# Altium project PROC154E3_SCH.PrjPcb (part 24 of 60)

## Sheet 25. SOC GND & KELVIN SENSING.SchDoc: SOC - GROUND & KELVIN SENSING
size 513 x 386 mm; Project: PROC154E2(001)_SK_AM69; Issue: 1.0; RevCode: E3; Page Create Date: March  8, 1995; Variant Name: Core Design; Schematic Page Number: 25; Page Number: 25; Page Size: C; Comment: MISTRAL_TITLEBLK_CSIZE_1; Page Count: 62; Schematic Page Count: 62; Name: PROC154E2 001 SK AM69; DsnPath: C:\Users\danie\Downloads\sprr466c\PROC154E3_RP\PROC154E3_SCH.DSN; SchematicName: SCHEMATIC1; PageName: 25. SOC GND & KELVIN SENSING; PageSize: C; TopSchematic: True
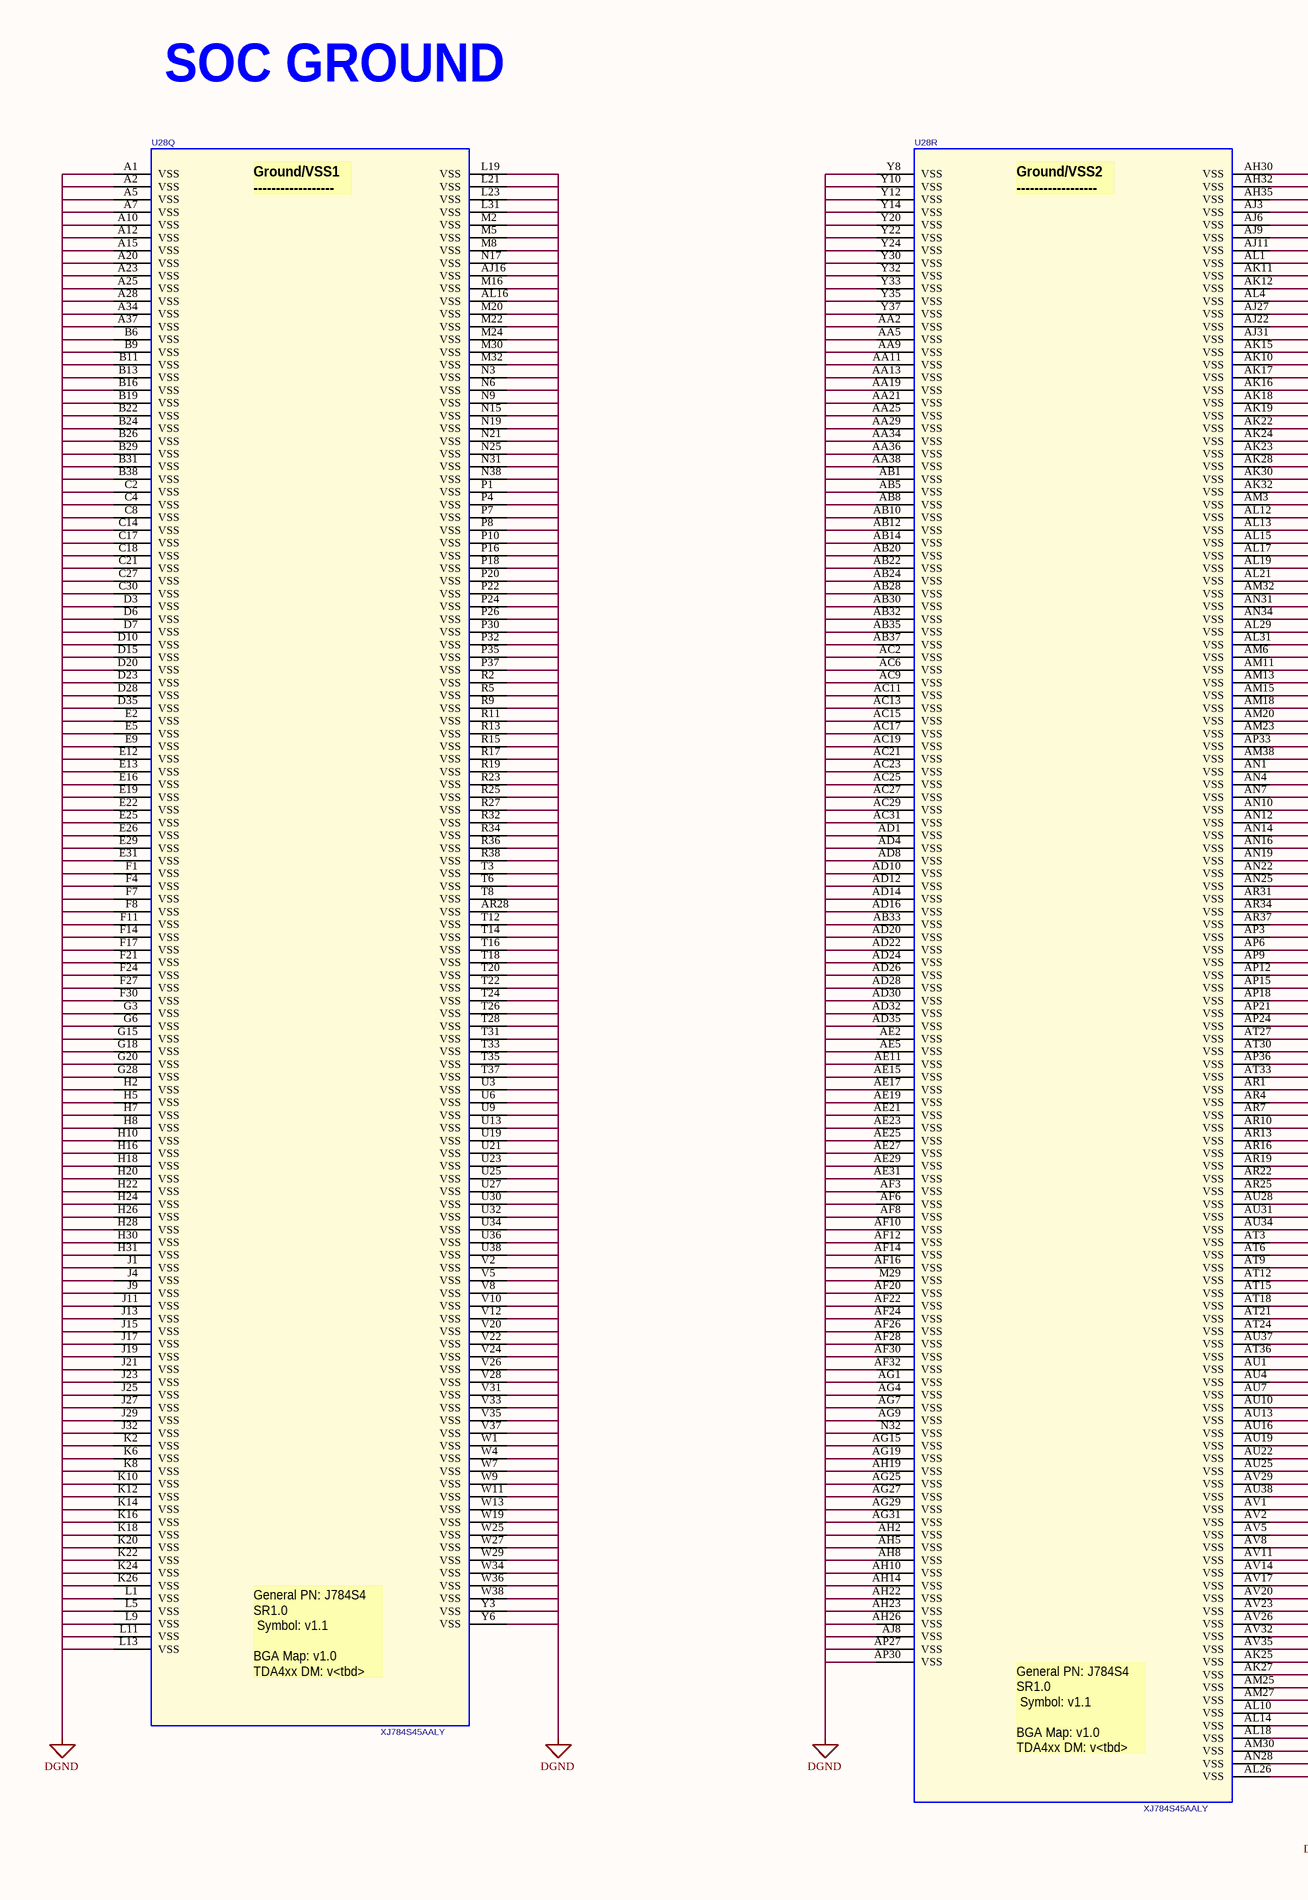
[diagram p38: 25. SOC GND & KELVIN SENSING.SchDoc, left]
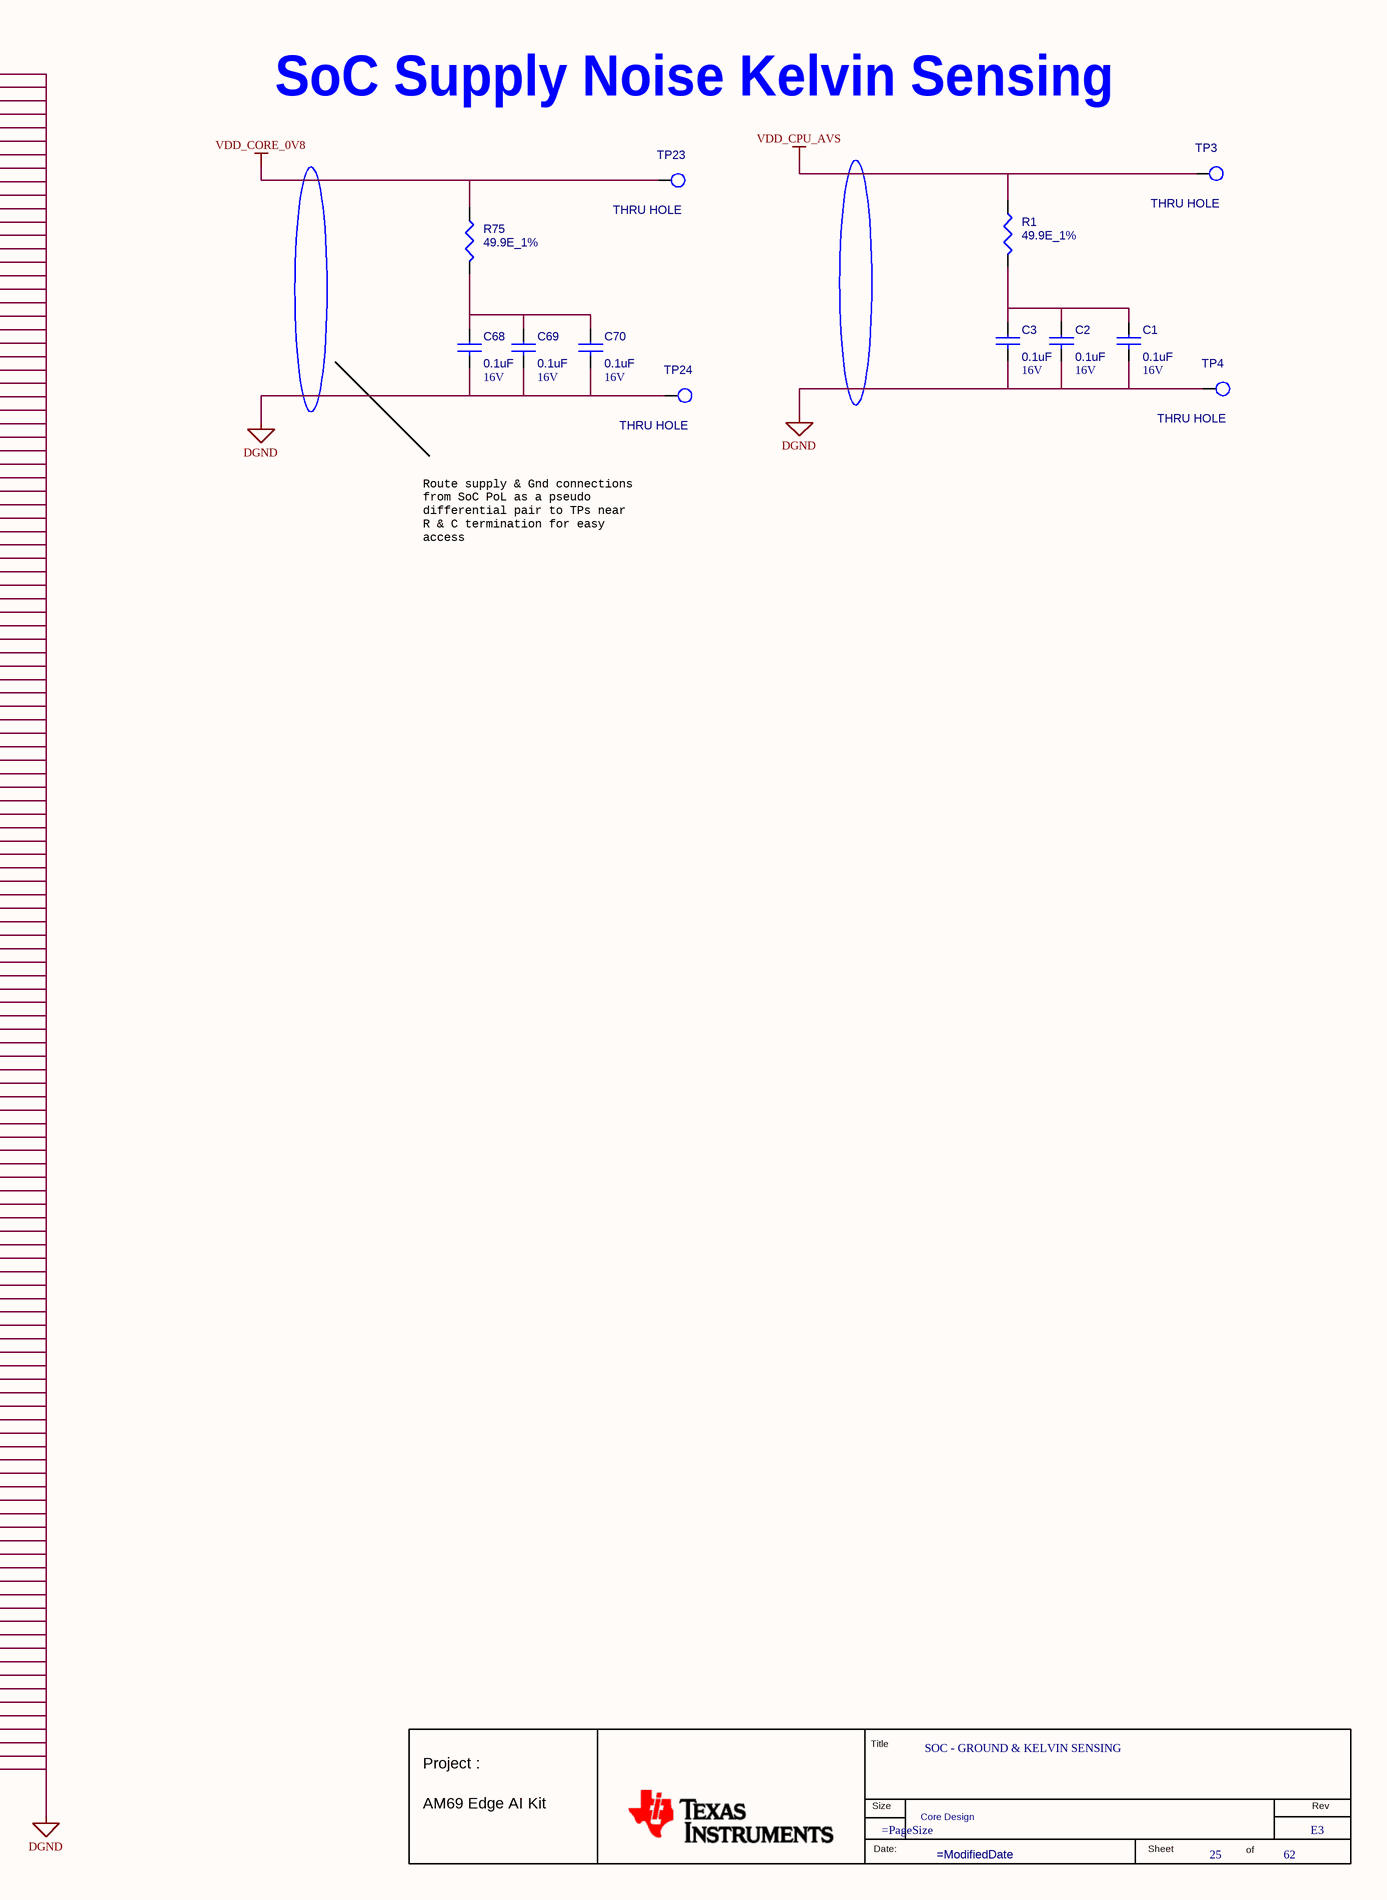
[diagram p39: 25. SOC GND & KELVIN SENSING.SchDoc, right]

### Parts
(Parts that share a designator on the sheet are numbered #1, #2 ... from top to bottom, then left to right.)
*#25  RevCode: E3  Title: SOC - GROUND & KELVIN SENSING  Page Number: 25  Page Count: 62  Variant Name: Core Design  (hidden comment: MISTRAL_TITLEBLK_CSIZE_1)  (graphical)
C1  0.1uF  Voltage: 16V  [CAP0402_0-75]
C2  0.1uF  Voltage: 16V  [CAP0402_0-75]
C3  0.1uF  Voltage: 16V  [CAP0402_0-75]
C68  0.1uF  Voltage: 16V  [CAP0402_0-75]
C69  0.1uF  Voltage: 16V  [CAP0402_0-75]
C70  0.1uF  Voltage: 16V  [CAP0402_0-75]
R1  49.9E_1%  [RES0402_0-5]
R75  49.9E_1%  [RES0402_0-5]
TP3  THRU HOLE  [TP_40X65]
TP4  THRU HOLE  [TP_40X65]
TP23  THRU HOLE  [TP_40X65]
TP24  THRU HOLE  [TP_40X65]
U28  XJ784S45AALY  [BGA1414_31-49_1230X1230_2-7]  (parts Q,R of 26)

### Nets
DGND: C1.2 C2.2 C3.2 C68.2 C69.2 C70.2 TP4.1(TP) TP24.1(TP) U28.A1(VSS) U28.A2(VSS) U28.A5(VSS) U28.A7(VSS) U28.A10(VSS) U28.A12(VSS) U28.A15(VSS) U28.A20(VSS) U28.A23(VSS) U28.A25(VSS) U28.A28(VSS) U28.A34(VSS) U28.A37(VSS) U28.AA2(VSS) U28.AA5(VSS) U28.AA9(VSS) U28.AA11(VSS) U28.AA13(VSS) U28.AA19(VSS) U28.AA21(VSS) U28.AA25(VSS) U28.AA29(VSS) U28.AA34(VSS) U28.AA36(VSS) U28.AA38(VSS) U28.AB1(VSS) U28.AB5(VSS) U28.AB8(VSS) U28.AB10(VSS) U28.AB12(VSS) U28.AB14(VSS) U28.AB20(VSS) U28.AB22(VSS) U28.AB24(VSS) U28.AB28(VSS) U28.AB30(VSS) U28.AB32(VSS) U28.AB33(VSS) U28.AB35(VSS) U28.AB37(VSS) U28.AC2(VSS) U28.AC6(VSS) U28.AC9(VSS) U28.AC11(VSS) U28.AC13(VSS) U28.AC15(VSS) U28.AC17(VSS) U28.AC19(VSS) U28.AC21(VSS) U28.AC23(VSS) U28.AC25(VSS) U28.AC27(VSS) U28.AC29(VSS) U28.AC31(VSS) U28.AD1(VSS) U28.AD4(VSS) U28.AD8(VSS) U28.AD10(VSS) U28.AD12(VSS) U28.AD14(VSS) U28.AD16(VSS) U28.AD20(VSS) U28.AD22(VSS) U28.AD24(VSS) U28.AD26(VSS) U28.AD28(VSS) U28.AD30(VSS) U28.AD32(VSS) U28.AD35(VSS) U28.AE2(VSS) U28.AE5(VSS) U28.AE11(VSS) U28.AE15(VSS) U28.AE17(VSS) U28.AE19(VSS) U28.AE21(VSS) U28.AE23(VSS) U28.AE25(VSS) U28.AE27(VSS) U28.AE29(VSS) U28.AE31(VSS) U28.AF3(VSS) U28.AF6(VSS) U28.AF8(VSS) U28.AF10(VSS) U28.AF12(VSS) U28.AF14(VSS) U28.AF16(VSS) U28.AF20(VSS) U28.AF22(VSS) U28.AF24(VSS) U28.AF26(VSS) U28.AF28(VSS) U28.AF30(VSS) U28.AF32(VSS) U28.AG1(VSS) U28.AG4(VSS) U28.AG7(VSS) U28.AG9(VSS) U28.AG15(VSS) U28.AG19(VSS) U28.AG25(VSS) U28.AG27(VSS) U28.AG29(VSS) U28.AG31(VSS) U28.AH2(VSS) U28.AH5(VSS) U28.AH8(VSS) U28.AH10(VSS) U28.AH14(VSS) U28.AH19(VSS) U28.AH22(VSS) U28.AH23(VSS) U28.AH26(VSS) U28.AH30(VSS) U28.AH32(VSS) U28.AH35(VSS) U28.AJ3(VSS) U28.AJ6(VSS) U28.AJ8(VSS) U28.AJ9(VSS) U28.AJ11(VSS) U28.AJ16(VSS) U28.AJ22(VSS) U28.AJ27(VSS) U28.AJ31(VSS) U28.AK10(VSS) U28.AK11(VSS) U28.AK12(VSS) U28.AK15(VSS) U28.AK16(VSS) U28.AK17(VSS) U28.AK18(VSS) U28.AK19(VSS) U28.AK22(VSS) U28.AK23(VSS) U28.AK24(VSS) U28.AK25(VSS) U28.AK27(VSS) U28.AK28(VSS) U28.AK30(VSS) U28.AK32(VSS) U28.AL1(VSS) U28.AL4(VSS) U28.AL10(VSS) U28.AL12(VSS) U28.AL13(VSS) U28.AL14(VSS) U28.AL15(VSS) U28.AL16(VSS) U28.AL17(VSS) U28.AL18(VSS) U28.AL19(VSS) U28.AL21(VSS) U28.AL26(VSS) U28.AL29(VSS) U28.AL31(VSS) U28.AM3(VSS) U28.AM6(VSS) U28.AM11(VSS) U28.AM13(VSS) U28.AM15(VSS) U28.AM18(VSS) U28.AM20(VSS) U28.AM23(VSS) U28.AM25(VSS) U28.AM27(VSS) U28.AM30(VSS) U28.AM32(VSS) U28.AM38(VSS) U28.AN1(VSS) U28.AN4(VSS) U28.AN7(VSS) U28.AN10(VSS) U28.AN12(VSS) U28.AN14(VSS) U28.AN16(VSS) U28.AN19(VSS) U28.AN22(VSS) U28.AN25(VSS) U28.AN28(VSS) U28.AN31(VSS) U28.AN34(VSS) U28.AP3(VSS) U28.AP6(VSS) U28.AP9(VSS) U28.AP12(VSS) U28.AP15(VSS) U28.AP18(VSS) U28.AP21(VSS) U28.AP24(VSS) U28.AP27(VSS) U28.AP30(VSS) U28.AP33(VSS) U28.AP36(VSS) U28.AR1(VSS) U28.AR4(VSS) U28.AR7(VSS) U28.AR10(VSS) U28.AR13(VSS) U28.AR16(VSS) U28.AR19(VSS) U28.AR22(VSS) U28.AR25(VSS) U28.AR28(VSS) U28.AR31(VSS) U28.AR34(VSS) U28.AR37(VSS) U28.AT3(VSS) U28.AT6(VSS) U28.AT9(VSS) U28.AT12(VSS) U28.AT15(VSS) U28.AT18(VSS) U28.AT21(VSS) U28.AT24(VSS) U28.AT27(VSS) U28.AT30(VSS) U28.AT33(VSS) U28.AT36(VSS) U28.AU1(VSS) U28.AU4(VSS) U28.AU7(VSS) U28.AU10(VSS) U28.AU13(VSS) U28.AU16(VSS) U28.AU19(VSS) U28.AU22(VSS) U28.AU25(VSS) U28.AU28(VSS) U28.AU31(VSS) U28.AU34(VSS) U28.AU37(VSS) U28.AU38(VSS) U28.AV1(VSS) U28.AV2(VSS) U28.AV5(VSS) U28.AV8(VSS) U28.AV11(VSS) U28.AV14(VSS) U28.AV17(VSS) U28.AV20(VSS) U28.AV23(VSS) U28.AV26(VSS) U28.AV29(VSS) U28.AV32(VSS) U28.AV35(VSS) U28.B6(VSS) U28.B9(VSS) U28.B11(VSS) U28.B13(VSS) U28.B16(VSS) U28.B19(VSS) U28.B22(VSS) U28.B24(VSS) U28.B26(VSS) U28.B29(VSS) U28.B31(VSS) U28.B38(VSS) U28.C2(VSS) U28.C4(VSS) U28.C8(VSS) U28.C14(VSS) U28.C17(VSS) U28.C18(VSS) U28.C21(VSS) U28.C27(VSS) U28.C30(VSS) U28.D3(VSS) U28.D6(VSS) U28.D7(VSS) U28.D10(VSS) U28.D15(VSS) U28.D20(VSS) U28.D23(VSS) U28.D28(VSS) U28.D35(VSS) U28.E2(VSS) U28.E5(VSS) U28.E9(VSS) U28.E12(VSS) U28.E13(VSS) U28.E16(VSS) U28.E19(VSS) U28.E22(VSS) U28.E25(VSS) U28.E26(VSS) U28.E29(VSS) U28.E31(VSS) U28.F1(VSS) U28.F4(VSS) U28.F7(VSS) U28.F8(VSS) U28.F11(VSS) U28.F14(VSS) U28.F17(VSS) U28.F21(VSS) U28.F24(VSS) U28.F27(VSS) U28.F30(VSS) U28.G3(VSS) U28.G6(VSS) U28.G15(VSS) U28.G18(VSS) U28.G20(VSS) U28.G28(VSS) U28.H2(VSS) U28.H5(VSS) U28.H7(VSS) U28.H8(VSS) U28.H10(VSS) U28.H16(VSS) U28.H18(VSS) U28.H20(VSS) U28.H22(VSS) U28.H24(VSS) U28.H26(VSS) U28.H28(VSS) U28.H30(VSS) U28.H31(VSS) U28.J1(VSS) U28.J4(VSS) U28.J9(VSS) U28.J11(VSS) U28.J13(VSS) U28.J15(VSS) U28.J17(VSS) U28.J19(VSS) U28.J21(VSS) U28.J23(VSS) U28.J25(VSS) U28.J27(VSS) U28.J29(VSS) U28.J32(VSS) U28.K2(VSS) U28.K6(VSS) U28.K8(VSS) U28.K10(VSS) U28.K12(VSS) U28.K14(VSS) U28.K16(VSS) U28.K18(VSS) U28.K20(VSS) U28.K22(VSS) U28.K24(VSS) U28.K26(VSS) U28.L1(VSS) U28.L5(VSS) U28.L9(VSS) U28.L11(VSS) U28.L13(VSS) U28.L19(VSS) U28.L21(VSS) U28.L23(VSS) U28.L31(VSS) U28.M2(VSS) U28.M5(VSS) U28.M8(VSS) U28.M16(VSS) U28.M20(VSS) U28.M22(VSS) U28.M24(VSS) U28.M29(VSS) U28.M30(VSS) U28.M32(VSS) U28.N3(VSS) U28.N6(VSS) U28.N9(VSS) U28.N15(VSS) U28.N17(VSS) U28.N19(VSS) U28.N21(VSS) U28.N25(VSS) U28.N31(VSS) U28.N32(VSS) U28.N38(VSS) U28.P1(VSS) U28.P4(VSS) U28.P7(VSS) U28.P8(VSS) U28.P10(VSS) U28.P16(VSS) U28.P18(VSS) U28.P20(VSS) U28.P22(VSS) U28.P24(VSS) U28.P26(VSS) U28.P30(VSS) U28.P32(VSS) U28.P35(VSS) U28.P37(VSS) U28.R2(VSS) U28.R5(VSS) U28.R9(VSS) U28.R11(VSS) U28.R13(VSS) U28.R15(VSS) U28.R17(VSS) U28.R19(VSS) U28.R23(VSS) U28.R25(VSS) U28.R27(VSS) U28.R32(VSS) U28.R34(VSS) U28.R36(VSS) U28.R38(VSS) U28.T3(VSS) U28.T6(VSS) U28.T8(VSS) U28.T12(VSS) U28.T14(VSS) U28.T16(VSS) U28.T18(VSS) U28.T20(VSS) U28.T22(VSS) U28.T24(VSS) U28.T26(VSS) U28.T28(VSS) U28.T31(VSS) U28.T33(VSS) U28.T35(VSS) U28.T37(VSS) U28.U3(VSS) U28.U6(VSS) U28.U9(VSS) U28.U13(VSS) U28.U19(VSS) U28.U21(VSS) U28.U23(VSS) U28.U25(VSS) U28.U27(VSS) U28.U30(VSS) U28.U32(VSS) U28.U34(VSS) U28.U36(VSS) U28.U38(VSS) U28.V2(VSS) U28.V5(VSS) U28.V8(VSS) U28.V10(VSS) U28.V12(VSS) U28.V20(VSS) U28.V22(VSS) U28.V24(VSS) U28.V26(VSS) U28.V28(VSS) U28.V31(VSS) U28.V33(VSS) U28.V35(VSS) U28.V37(VSS) U28.W1(VSS) U28.W4(VSS) U28.W7(VSS) U28.W9(VSS) U28.W11(VSS) U28.W13(VSS) U28.W19(VSS) U28.W25(VSS) U28.W27(VSS) U28.W29(VSS) U28.W34(VSS) U28.W36(VSS) U28.W38(VSS) U28.Y3(VSS) U28.Y6(VSS) U28.Y8(VSS) U28.Y10(VSS) U28.Y12(VSS) U28.Y14(VSS) U28.Y20(VSS) U28.Y22(VSS) U28.Y24(VSS) U28.Y30(VSS) U28.Y32(VSS) U28.Y33(VSS) U28.Y35(VSS) U28.Y37(VSS)  [project net VDD_CPU_HCPS_GOSNS]
VDD_CORE_0V8: R75.1 TP23.1(TP)  [project net VDD_WAKE0]
VDD_CPU_AVS: R1.1 TP3.1(TP)  [project net VDD_CPU_HCPS_VOSNS]
NetC1_1: C1.1 C2.1 C3.1 R1.2
NetC68_1: C68.1 C69.1 C70.1 R75.2

### Notes on the sheet
- SOC GROUND
- SoC Supply Noise Kelvin Sensing
- Route supply & Gnd connections
  from SoC PoL as a pseudo
  differential pair to TPs near
  R & C termination for easy
  access
- (in symbol J7AHPSoC-EVM_BGA1414, part Q) Ground/VSS1 / ------------------; General PN: J784S4 / SR1.0 / Symbol: v1.1 / BGA Map: v1.0 / TDA4xx DM: v<tbd>
- (in symbol J7AHPSoC-EVM_BGA1414, part R) Ground/VSS2 / ------------------; General PN: J784S4 / SR1.0 / Symbol: v1.1 / BGA Map: v1.0 / TDA4xx DM: v<tbd>
- (in symbol MISTRAL_TITLEBLK_CSIZE_1) Title; Project :; Size; Rev; AM69 Edge AI Kit; Date:; Sheet; of

### Library data of the parts
*#25 = MISTRAL_TITLEBLK_CSIZE_1: Issue: 1.0; Project: PROC154E2(001)_SK_AM69; Name: PROC154E2 001 SK AM69; Page Create Date: March  8, 1995; Page Size: =PageSize; Page Modify Date: =ModifiedDate; Schematic Page Count: 62; Schematic Page Number: 25
C1 = CAP_Dup1: CAP CERAMIC 0.1uF 16V 10% X7R AUTO 0402; Part Reference: C1; Manufacturer: MURATA; Automotive Alternate_mfr_part_number: CGA2B1X7R1C104K050BC; Automotive Alternate_mfr_name: TDK; Part_type: CAPACITORS\CERAMIC; Mfr_part_number: GCM155R71C104KA55D; Mistral Part No: 120016070006-R; Custom_Duty: 15%; Customs_HS_Code: 85322990; Wattage: NA; Project: DCMIST_FPGA_CARD; Value: 0.1uF; PCB Footprint: CAP0402_0-75; Direct Alternate_mfr_part_number: CGA2B1X7R1C104K050BC; Direct Alternate_mfr_name: TDK; MECHANICAL 3D STEP FILE: CAP0402_0-75; Footprint Path: Y:\MIS_DATABASE\Library\ALTIUM_TOOL\PCB_FOOTPRINTS\Altium_Footprint_Lib.PcbLib; Library Path: Y:\MIS_DATABASE\Library\ALTIUM_TOOL\SCHEMATICS_PARTS\MS_DISCRETE_Library.schlib; Chkd/date: NAVEED/021014; Crtd /date: VASANTHA/300514; Datasheet: Y:\MIS_DATABASE\DATASHEETS\CAPACITORS\MURATA-GCM-SER.PDF; Temperature: -55°C+125°C; Weight: 6mg; Height: 0.55MM; Library Ref: CAP; Distributor_part_number: 490-4759-1-ND; Distributor_name: DIGIKEY; Package: 0402; Tolerance: 10%; Mfr_name: MURATA; Footprint Ref: CAP0402_0-75
C2 = CAP_Dup1: CAP CERAMIC 0.1uF 16V 10% X7R AUTO 0402; Part Reference: C2; Manufacturer: MURATA; Automotive Alternate_mfr_part_number: CGA2B1X7R1C104K050BC; Automotive Alternate_mfr_name: TDK; Mistral Part No: 120016070006-R; Mfr_part_number: GCM155R71C104KA55D; Part_type: CAPACITORS\CERAMIC; Project: DCMIST_FPGA_CARD; Wattage: NA; Customs_HS_Code: 85322990; Custom_Duty: 15%; Value: 0.1uF; PCB Footprint: CAP0402_0-75; Direct Alternate_mfr_part_number: CGA2B1X7R1C104K050BC; Direct Alternate_mfr_name: TDK; Footprint Ref: CAP0402_0-75; Mfr_name: MURATA; Tolerance: 10%; Package: 0402; Distributor_name: DIGIKEY; Distributor_part_number: 490-4759-1-ND; Library Ref: CAP; Height: 0.55MM; Weight: 6mg; Temperature: -55°C+125°C; Datasheet: Y:\MIS_DATABASE\DATASHEETS\CAPACITORS\MURATA-GCM-SER.PDF; Crtd /date: VASANTHA/300514; Chkd/date: NAVEED/021014; Library Path: Y:\MIS_DATABASE\Library\ALTIUM_TOOL\SCHEMATICS_PARTS\MS_DISCRETE_Library.schlib; Footprint Path: Y:\MIS_DATABASE\Library\ALTIUM_TOOL\PCB_FOOTPRINTS\Altium_Footprint_Lib.PcbLib; MECHANICAL 3D STEP FILE: CAP0402_0-75
C3 = CAP_Dup1: CAP CERAMIC 0.1uF 16V 10% X7R AUTO 0402; Part Reference: C3; Manufacturer: MURATA; Automotive Alternate_mfr_part_number: CGA2B1X7R1C104K050BC; Automotive Alternate_mfr_name: TDK; Mistral Part No: 120016070006-R; Mfr_part_number: GCM155R71C104KA55D; Part_type: CAPACITORS\CERAMIC; Project: DCMIST_FPGA_CARD; Wattage: NA; Customs_HS_Code: 85322990; Custom_Duty: 15%; Value: 0.1uF; PCB Footprint: CAP0402_0-75; Direct Alternate_mfr_part_number: CGA2B1X7R1C104K050BC; Direct Alternate_mfr_name: TDK; Footprint Ref: CAP0402_0-75; Mfr_name: MURATA; Tolerance: 10%; Package: 0402; Distributor_name: DIGIKEY; Distributor_part_number: 490-4759-1-ND; Library Ref: CAP; Height: 0.55MM; Weight: 6mg; Temperature: -55°C+125°C; Datasheet: Y:\MIS_DATABASE\DATASHEETS\CAPACITORS\MURATA-GCM-SER.PDF; Crtd /date: VASANTHA/300514; Chkd/date: NAVEED/021014; Library Path: Y:\MIS_DATABASE\Library\ALTIUM_TOOL\SCHEMATICS_PARTS\MS_DISCRETE_Library.schlib; Footprint Path: Y:\MIS_DATABASE\Library\ALTIUM_TOOL\PCB_FOOTPRINTS\Altium_Footprint_Lib.PcbLib; MECHANICAL 3D STEP FILE: CAP0402_0-75
C68 = CAP_Dup1: CAP CERAMIC 0.1uF 16V 10% X7R AUTO 0402; Part Reference: C68; Manufacturer: MURATA; Mistral Part No: 120016070006-R; Mfr_part_number: GCM155R71C104KA55D; Part_type: CAPACITORS\CERAMIC; Direct Alternate_mfr_name: TDK; Direct Alternate_mfr_part_number: CGA2B1X7R1C104K050BC; Project: DCMIST_FPGA_CARD; Wattage: NA; Customs_HS_Code: 85322990; Custom_Duty: 15%; Value: 0.1uF; PCB Footprint: CAP0402_0-75; Footprint Ref: CAP0402_0-75; Mfr_name: MURATA; Tolerance: 10%; Package: 0402; Distributor_name: DIGIKEY; Distributor_part_number: 490-4759-1-ND; Library Ref: CAP; Height: 0.55MM; Weight: 6mg; Temperature: -55°C+125°C; Datasheet: Y:\MIS_DATABASE\DATASHEETS\CAPACITORS\MURATA-GCM-SER.PDF; Crtd /date: VASANTHA/300514; Chkd/date: NAVEED/021014; Library Path: Y:\MIS_DATABASE\Library\ALTIUM_TOOL\SCHEMATICS_PARTS\MS_DISCRETE_Library.schlib; Footprint Path: Y:\MIS_DATABASE\Library\ALTIUM_TOOL\PCB_FOOTPRINTS\Altium_Footprint_Lib.PcbLib; MECHANICAL 3D STEP FILE: CAP0402_0-75; Automotive Alternate_mfr_name: TDK; Automotive Alternate_mfr_part_number: CGA2B1X7R1C104K050BC
C69 = CAP_Dup1: CAP CERAMIC 0.1uF 16V 10% X7R AUTO 0402; Part Reference: C69; Manufacturer: MURATA; Mistral Part No: 120016070006-R; Mfr_part_number: GCM155R71C104KA55D; Part_type: CAPACITORS\CERAMIC; Direct Alternate_mfr_name: TDK; Direct Alternate_mfr_part_number: CGA2B1X7R1C104K050BC; Project: DCMIST_FPGA_CARD; Wattage: NA; Customs_HS_Code: 85322990; Custom_Duty: 15%; Value: 0.1uF; PCB Footprint: CAP0402_0-75; Footprint Ref: CAP0402_0-75; Mfr_name: MURATA; Tolerance: 10%; Package: 0402; Distributor_name: DIGIKEY; Distributor_part_number: 490-4759-1-ND; Library Ref: CAP; Height: 0.55MM; Weight: 6mg; Temperature: -55°C+125°C; Datasheet: Y:\MIS_DATABASE\DATASHEETS\CAPACITORS\MURATA-GCM-SER.PDF; Crtd /date: VASANTHA/300514; Chkd/date: NAVEED/021014; Library Path: Y:\MIS_DATABASE\Library\ALTIUM_TOOL\SCHEMATICS_PARTS\MS_DISCRETE_Library.schlib; Footprint Path: Y:\MIS_DATABASE\Library\ALTIUM_TOOL\PCB_FOOTPRINTS\Altium_Footprint_Lib.PcbLib; MECHANICAL 3D STEP FILE: CAP0402_0-75; Automotive Alternate_mfr_name: TDK; Automotive Alternate_mfr_part_number: CGA2B1X7R1C104K050BC
C70 = CAP_Dup1: CAP CERAMIC 0.1uF 16V 10% X7R AUTO 0402; Part Reference: C70; Manufacturer: MURATA; Part_type: CAPACITORS\CERAMIC; Mfr_part_number: GCM155R71C104KA55D; Mistral Part No: 120016070006-R; Direct Alternate_mfr_name: TDK; Direct Alternate_mfr_part_number: CGA2B1X7R1C104K050BC; Custom_Duty: 15%; Customs_HS_Code: 85322990; Wattage: NA; Project: DCMIST_FPGA_CARD; Value: 0.1uF; PCB Footprint: CAP0402_0-75; MECHANICAL 3D STEP FILE: CAP0402_0-75; Footprint Path: Y:\MIS_DATABASE\Library\ALTIUM_TOOL\PCB_FOOTPRINTS\Altium_Footprint_Lib.PcbLib; Library Path: Y:\MIS_DATABASE\Library\ALTIUM_TOOL\SCHEMATICS_PARTS\MS_DISCRETE_Library.schlib; Chkd/date: NAVEED/021014; Crtd /date: VASANTHA/300514; Datasheet: Y:\MIS_DATABASE\DATASHEETS\CAPACITORS\MURATA-GCM-SER.PDF; Temperature: -55°C+125°C; Weight: 6mg; Height: 0.55MM; Library Ref: CAP; Distributor_part_number: 490-4759-1-ND; Distributor_name: DIGIKEY; Package: 0402; Tolerance: 10%; Mfr_name: MURATA; Footprint Ref: CAP0402_0-75; Automotive Alternate_mfr_name: TDK; Automotive Alternate_mfr_part_number: CGA2B1X7R1C104K050BC
R1 = RESISTOR_Dup2: RES 49.9E 1/10W 1% 0402; Part Reference: R1; Part_type: RESISTORS\FIXED; Mfr_part_number: ERJ-2RKF49R9X; Manufacturer: PANASONIC-ECG; Mistral Part No: 110009030897-R; Custom_Duty: 15%; Customs_HS_Code: 85332119; Voltage: NA; Project: RED EYE; Value: 49.9E_1%; PCB Footprint: RES0402_0-5; Footprint Path: Y:\MIS_DATABASE\Library\ALTIUM_TOOL\PCB_FOOTPRINTS\Altium_Footprint_Lib.PcbLib; Library Path: Y:\MIS_DATABASE\Library\ALTIUM_TOOL\SCHEMATICS_PARTS\MS_DISCRETE_Library.schlib; MECHANICAL 3D STEP FILE: RES0402_0-5; Chkd/date: VASANTHA/201216; Crtd /date: MAZHAR/201005; Datasheet: Y:\MIS_DATABASE\DATASHEETS\RESISTORS\PAN-ERJSER_NOV17.PDF; Temperature: -55°C+155°C; Weight: 0.8mg; Height: 0.40MM; Library Ref: RESISTOR; Distributor_part_number: P49.9LCT-ND; Distributor_name: DIGIKEY; Package: 0402; Wattage: 1/10W; Tolerance: 1%; Footprint Ref: RES0402_0-5; Mfr_name: PANASONIC-ECG
R75 = RESISTOR_Dup2: RES 49.9E 1/10W 1% 0402; Part Reference: R75; Mistral Part No: 110009030897-R; Manufacturer: PANASONIC-ECG; Mfr_part_number: ERJ-2RKF49R9X; Part_type: RESISTORS\FIXED; Project: RED EYE; Voltage: NA; Customs_HS_Code: 85332119; Custom_Duty: 15%; Value: 49.9E_1%; PCB Footprint: RES0402_0-5; Footprint Ref: RES0402_0-5; Tolerance: 1%; Wattage: 1/10W; Package: 0402; Distributor_name: DIGIKEY; Distributor_part_number: P49.9LCT-ND; Library Ref: RESISTOR; Height: 0.40MM; Weight: 0.8mg; Temperature: -55°C+155°C; Datasheet: Y:\MIS_DATABASE\DATASHEETS\RESISTORS\PAN-ERJSER_NOV17.PDF; Crtd /date: MAZHAR/201005; Chkd/date: VASANTHA/201216; MECHANICAL 3D STEP FILE: RES0402_0-5; Library Path: Y:\MIS_DATABASE\Library\ALTIUM_TOOL\SCHEMATICS_PARTS\MS_DISCRETE_Library.schlib; Footprint Path: Y:\MIS_DATABASE\Library\ALTIUM_TOOL\PCB_FOOTPRINTS\Altium_Footprint_Lib.PcbLib; Mfr_name: PANASONIC-ECG
TP3 = TESTPOINT_Dup1: TESTPOINT 1.0MM DRILL PTH; Part Reference: TP3; Manufacturer: LOCAL; Mistral Part No: 130009030938; Project: HSE; Value: THRU HOLE; PCB Footprint: TP_40X65; Library Ref: TESTPOINT; Chkd/date: MAZHAR/271211; Crtd /date: SHREESHAIL/041005; Datasheet: NA; Height: NA; Distributor_part_number: NA; Distributor_name: NA; Package: THRU-HOLE; Part_type: TESTPOINT; Mfr_part_number: TP_40X65; Mfr_name: LOCAL
TP4 = TESTPOINT_Dup1: TESTPOINT 1.0MM DRILL PTH; Part Reference: TP4; Manufacturer: LOCAL; Mistral Part No: 130009030938; Project: HSE; Value: THRU HOLE; PCB Footprint: TP_40X65; Mfr_name: LOCAL; Mfr_part_number: TP_40X65; Part_type: TESTPOINT; Package: THRU-HOLE; Distributor_name: NA; Distributor_part_number: NA; Height: NA; Datasheet: NA; Crtd /date: SHREESHAIL/041005; Chkd/date: MAZHAR/271211; Library Ref: TESTPOINT
TP23 = TESTPOINT_Dup1: TESTPOINT 1.0MM DRILL PTH; Part Reference: TP23; Manufacturer: LOCAL; Mistral Part No: 130009030938; Project: HSE; Value: THRU HOLE; PCB Footprint: TP_40X65; Library Ref: TESTPOINT; Chkd/date: MAZHAR/271211; Crtd /date: SHREESHAIL/041005; Datasheet: NA; Height: NA; Distributor_part_number: NA; Distributor_name: NA; Package: THRU-HOLE; Part_type: TESTPOINT; Mfr_part_number: TP_40X65; Mfr_name: LOCAL
TP24 = TESTPOINT_Dup1: TESTPOINT 1.0MM DRILL PTH; Part Reference: TP24; Manufacturer: LOCAL; Mistral Part No: 130009030938; Project: HSE; Value: THRU HOLE; PCB Footprint: TP_40X65; Mfr_name: LOCAL; Mfr_part_number: TP_40X65; Part_type: TESTPOINT; Package: THRU-HOLE; Distributor_name: NA; Distributor_part_number: NA; Height: NA; Datasheet: NA; Crtd /date: SHREESHAIL/041005; Chkd/date: MAZHAR/271211; Library Ref: TESTPOINT
U28 = J7AHPSoC-EVM_BGA1414: IC AM69 SoC EVM MICROPROCESSOR BGA1414; Part Reference: U28; Mistral Part No: 141230020002; Mfr_name: TEXAS INSTRUMENTS; Part_type: ICS\DIGITAL\MICROPROCESSOR; SPLIT_INST: TRUE; SWAP_INFO: (S1+S2+S3+S4+S5+S6+S7+S8+S9+S10+S11+S12+S13+S14+S15+S16+S17+S18+S19+S20+S21+S22+S23+S24+S25+S26); Project: TI_J7AHP SK_BRD; Tolerance: NA; Customs_HS_Code: 85423100; Custom_Duty: 15%; Value: XJ784S45AALY; PCB Footprint: BGA1414_31-49_1230X1230_2-7; Footprint Ref: BGA1414_31-49_1230X1230_2-7; Mfr_part_number: XJ784S45AALY; Voltage: NA; Wattage: NA; Package: BGA1414; Distributor_name: NA; Distributor_part_number: NA; Library Ref: J7AHPSoC-EVM_BGA1414; Height: 2.70MM; Weight: NA; Temperature: NA; Datasheet: Y:\MIS_DATABASE\DATASHEETS\ICS\DIGITAL\MICROCONTROLLER\J7AHP-SoC-EVM.PDF; Crtd /date: ALVY/141221; Chkd/date: MANIRAJA/151221; RoHS: NA; MECHANICAL 3D STEP FILE: BGA1414_31-49_1230X1230_2-7; Library Path: Y:\MIS_DATABASE\Library\ALTIUM_TOOL\SCHEMATICS_PARTS\MS_MICROPROCESSOR_Library.schlib; Footprint Path: Y:\MIS_DATABASE\Library\ALTIUM_TOOL\PCB_FOOTPRINTS\Altium_Footprint_Lib.PcbLib; Manufacturer: TEXAS INSTRUMENTS